# EAGLE design Atmel328p SlideOver (EAGLE 6.6.0)
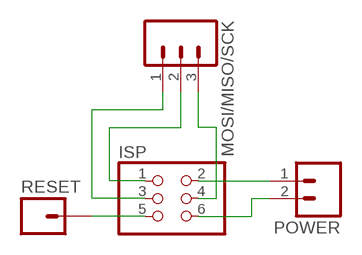
[diagram p0: schematic, sheet 1]

## Parts
ISP  PINHD-2X3  [2X03]
MOSI/MISO/SCK  M03PTH  [1X03]
POWER  M02PTH  [1X02]
RESET  M01PTH  [1X01]

## Nets
N$1: ISP.5 RESET.1
N$3: ISP.6 POWER.2
N$4: ISP.3 MOSI/MISO/SCK.1
N$5: ISP.1 MOSI/MISO/SCK.2
N$6: ISP.4 MOSI/MISO/SCK.3
POWER: ISP.2 POWER.1

## Library data of the parts
ISP = pinhead:PINHD-2X3: PIN HEADER
MOSI/MISO/SCK = SparkFun-Connectors:M03: Header 3 Standard 3-pin 0.1" header. Use with straight break away headers (SKU : PRT-00116), right angle break away headers (PRT-00553), swiss pins (PRT-00743), machine pins (PRT-00117), and female headers (PRT-00115). Molex polarized connector foot print use with SKU : PRT-08232 with associated crimp pins and housings.
POWER = SparkFun-Connectors:M02: Standard 2-pin 0.1" header. Use with - straight break away headers ( PRT-00116) - right angle break away headers (PRT-00553) - swiss pins (PRT-00743) - machine pins (PRT-00117) - female headers (PRT-00115) Molex polarized connector foot print use with: PRT-08233 with associated crimp pins and housings. 2.54_SCREWTERM for use with PRT-10571. 3.5mm Screw Terminal footprints for PRT-08084 5mm Screw Terminal footprints for use with PRT-08432
RESET = SparkFun-Connectors:M01: Header 1 Standard 1-pin 0.1" header. Use with straight break away headers (SKU : PRT-00116), right angle break away headers (PRT-00553), swiss pins (PRT-00743), machine pins (PRT-00117), and female headers (PRT-00115).

## Board
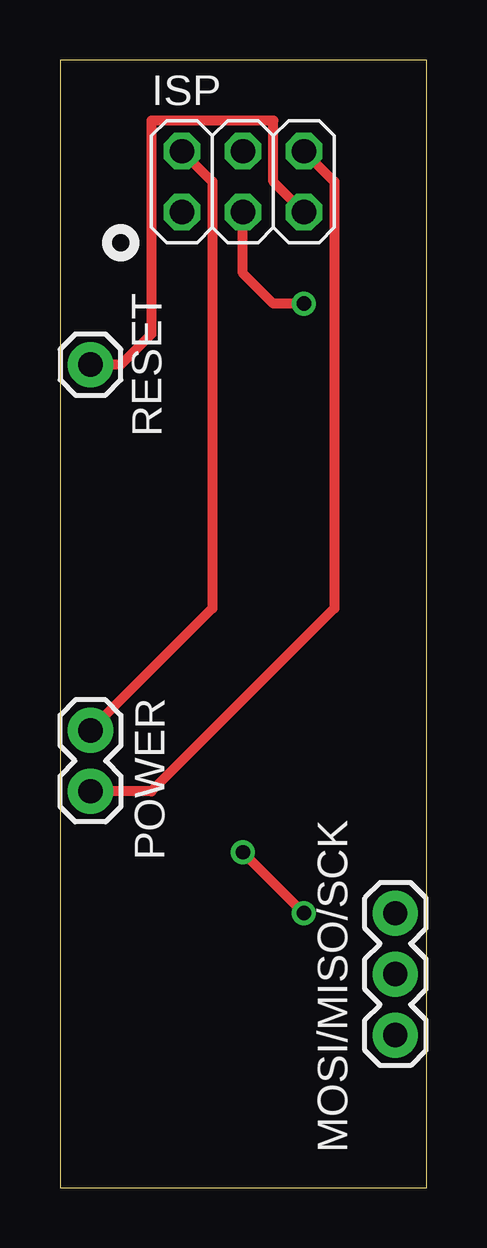
[diagram p1: board, top side]
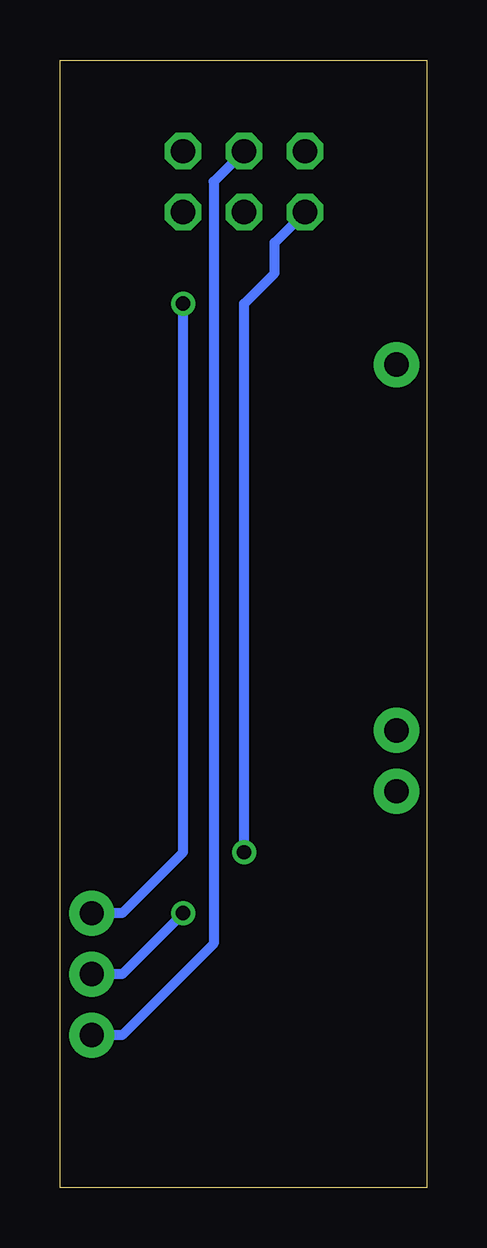
[diagram p2: board, bottom side, seen from below]

Size 15.29 x 46.98 mm. Coordinates in mm from the lower left corner, seen from the top.
Outline: 0,0 15.29,0 15.29,46.98 0,46.98 0,0
Copper layers (1*16): Top 0.035mm / dielectric 1.5mm / Bottom 0.035mm
Design rules "default": minimum track width 10mil, minimum drill 24mil, track to track 8mil, track to pad 8mil, pad to pad 8mil, via to via 8mil, smd to smd 8mil, copper to edge 40mil, drill to drill 8mil, minimum pad ring 10mil, minimum via ring 8mil, stop-mask expansion 4mil, vias tented up to drill 0mil, thermal gap 10mil

### Footprints (pad centres in the part's own frame; a part is rotated, then mirrored left to right if it is on the bottom)
2X03 = drill 1.016 octagon: 1 -2.54,-1.27; 2 -2.54,1.27; 3 0,-1.27; 4 0,1.27; 5 2.54,-1.27; 6 2.54,1.27
1X03 = drill 1.016 pad 1.88: 1 0,0; 2 2.54,0; 3 5.08,0
1X02 = drill 1.016 pad 1.88: 1 0,0; 2 2.54,0
1X01 = drill 1.016 pad 1.88: 1 0,0

### Placement (x,y rotation side)
ISP  7.62,41.91 0 top
MOSI/MISO/SCK  13.97,11.43 270 top
POWER  1.27,19.05 270 top
RESET  1.27,34.29 0 top

### Tracks (layer width: path | path; a pad name or v marks a point on that pad's centre or on a via)
N$1
  Top 0.406: ISP.5 8.89,41.91 8.89,44.45 3.81,44.45 3.81,35.56 2.54,34.29 RESET.1
N$3
  Top 0.406: ISP.6 11.43,41.91 11.43,24.13 3.81,16.51 POWER.2
N$4  (via drill 0.6)
  Top 0.406: v10.16,36.83 8.89,36.83 7.62,38.1 ISP.3
  Bottom 0.406: v10.16,36.83 10.16,13.97 12.7,11.43 MOSI/MISO/SCK.1
N$5  (via drill 0.6)
  Top 0.406: v10.16,11.43 v7.62,13.97
  Bottom 0.406: v10.16,11.43 12.7,8.89 MOSI/MISO/SCK.2 | v7.62,13.97 7.62,36.83 6.35,38.1 6.35,39.37 ISP.1
N$6
  Bottom 0.406: ISP.4 8.89,41.91 8.89,10.16 12.7,6.35 MOSI/MISO/SCK.3
N$7  (via drill 0.6)
  other vias: 10.16,11.43
N$8  (via drill 0.6)
  other vias: 7.62,13.97
POWER
  Top 0.406: ISP.2 6.35,41.91 6.35,24.13 POWER.1